# EAGLE schematic 1.5 Volt Headphone Amplifier (EAGLE 7.2.0)
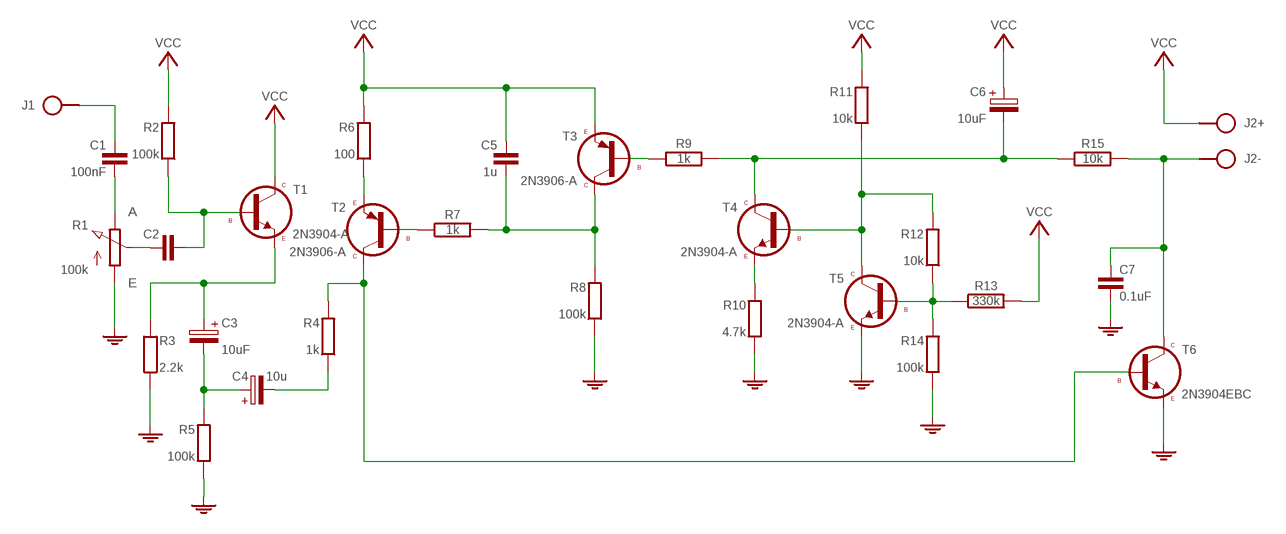
[diagram p0: schematic, sheet 1]

## Parts
C1  100nF  C050-025X075/V  [C050-025X075/V]
C2  C-H050-025X075/V  [C050-025X075/V]
C3  10uF  CPOLE2.5-5  [E2,5-5]
C4  10u  CPOL-HE2,5-5/V  [E2,5-5/V]
C5  1u  C050-025X075/V  [C050-025X075/V]
C6  10uF  CPOLE2.5-5  [E2,5-5]
C7  0.1uF  C050-025X075/V  [C050-025X075/V]
J1  IN  HPORT  [SPAD]
J2  HDPH  SPAD+-+-  [SPAD+-]
R1  100k  POT-TRIM  [TRIM-POT]
R2  100k  R0204/10-V  [0204/10-V]
R3  2.2k  R0204/10-V  [0204/10-V]
R4  1k  R0204/10-V  [0204/10-V]
R5  100k  R0204/10-V  [0204/10-V]
R6  100  R0204/10-V  [0204/10-V]
R7  1k  R-H0204/10  [0204/10]
R8  100k  R0204/10-V  [0204/10-V]
R9  1k  R-H0204/10  [0204/10]
R10  4.7k  R0204/10-V  [0204/10-V]
R11  10k  R0204/10-V  [0204/10-V]
R12  10k  R0204/10-V  [0204/10-V]
R13  330k  R-H0204/10  [0204/10]
R14  100k  R0204/10-V  [0204/10-V]
R15  10k  R-H0204/10  [0204/10]
T1  2N3904-A  [TO92-EBC-A]
T2  2N3906-A  [TO92-EBC-A]
T3  2N3906-A  [TO92-EBC-A]
T4  2N3904-A  [TO92-EBC-A]
T5  2N3904-A  [TO92-EBC-A]
T6  2N3904EBC  [TO92-EBC]

## Nets
GND: C7.2 R1.A R3.2 R5.2 R8.2 R10.2 R14.2 T5.E T6.E
N$1: C1.2 R1.E
N$2: C2.1 R1.S
N$3: C2.2 R2.2 T1.B
N$4: C3.+ R3.1 T1.E
N$5: C3.- C4.+
N$6: C4.- R4.2
N$7: R4.1 T2.C T6.B
N$8: R7.1 T2.B
N$9: R6.2 T2.E
N$10: R9.1 T3.B
N$11: C1.1 J1.1
N$12: C5.2 R7.2 R8.1 T3.C
N$13: R10.1 T4.E
N$15: R11.2 R12.1 T4.B T5.C
N$16: C6.- R9.2 R15.1 T4.C
N$17: R12.2 R13.1 R14.1 T5.B
N$18: C7.1 J2.1 R15.2 T6.C
VCC: C5.1 C6.+ J2.2 R2.1 R6.1 R11.1 R13.2 T1.C T3.E
Unconnected: R5.1

## Library data of the parts
C1 C5 C7 = c:C: CAPACITOR, European symbol
C2 = c:C-H
C3 C6 = c:CPOL: POLARIZED CAPACITOR, European symbol
C4 = c:CPOL-H
J1 = pad:HPORT
J2 = pad:SPAD+-
R1 = r:POT
R2-R6 R8 R10-R12 R14 = r:R: RESISTOR, European symbol
R7 R9 R13 R15 = r:R-H
T1 T4-T6 = t:2N3904
T2 T3 = t:2N3906